# EAGLE design cell (EAGLE 7.5.0)
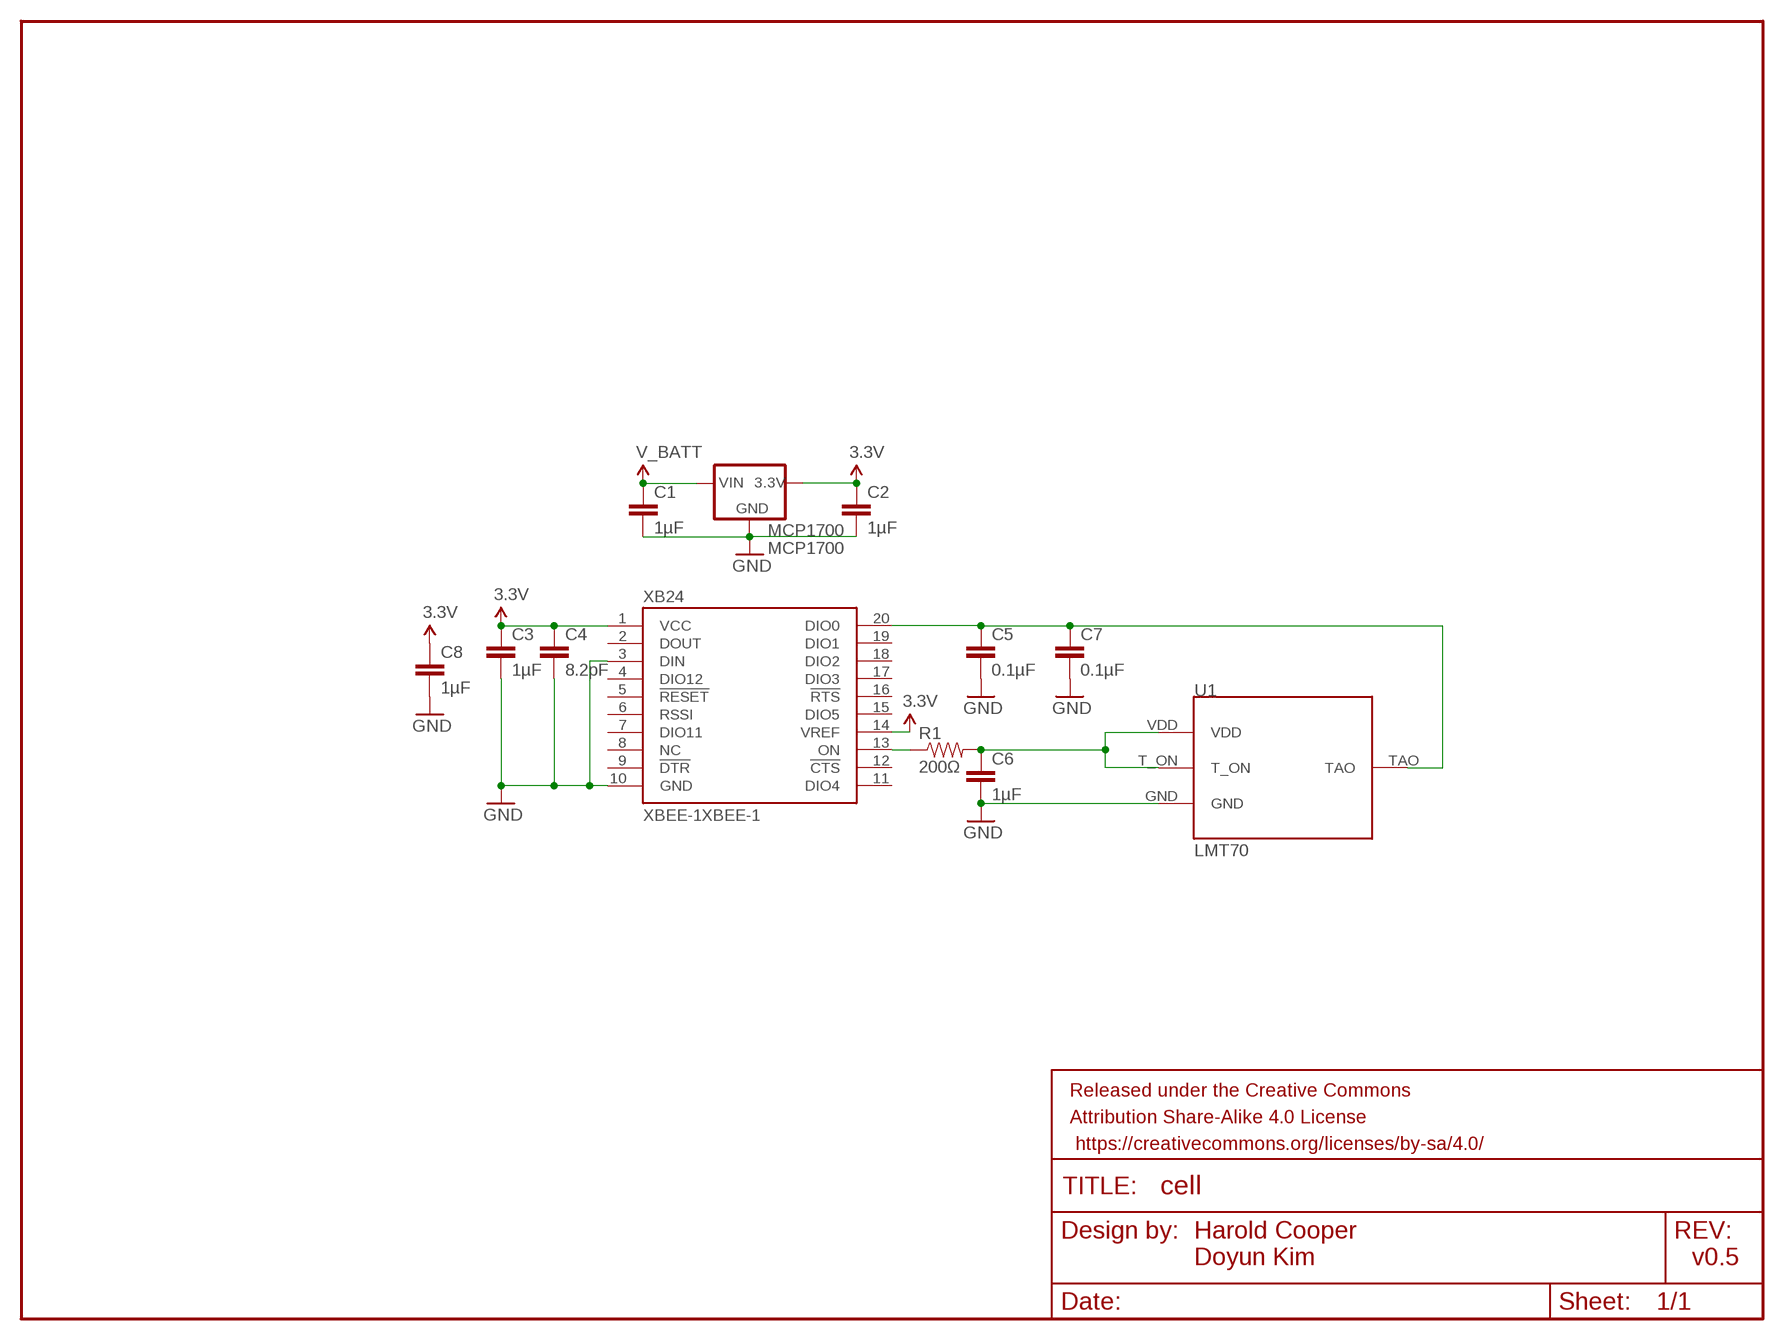
[diagram p0: schematic, sheet 1]

## Parts
C1  1µF  CAP0805  [0805]
C2  1µF  CAP0805  [0805]
C3  1µF  CAP0805  [0805]
C4  8.2pF  CAP0805  [0805]
C5  0.1µF  CAP0805  [0805]
C6  1µF  CAP0805  [0805]
C7  0.1µF  CAP0805  [0805]
C8  1µF  CAP0805  [0805]
FRAME1  FRAME-LETTER  [CREATIVE_COMMONS]
MCP1700  MCP1700  [SOT-89-3]
R1  200Ω  RESISTOR0805-RES  [0805]
U1  LMT70  [YFP0004]
XB24  XBEE-1XBEE-1  [XBEE-1]

## Nets
3.3V: C2.1 C3.1 C4.1 C8.1 MCP1700.3(3.3V) XB24.1(VCC) XB24.14(VREF)
GND: C1.2 C2.2 C3.2 C4.2 C5.2 C6.2 C7.2 C8.2 MCP1700.1(GND) U1.GND XB24.3(DIN) XB24.10(GND)
N$1: C6.1 R1.2 U1.T_ON U1.VDD
N$2: R1.1 XB24.13(ON)
N$7: C5.1 C7.1 U1.TAO XB24.20(DIO0)
V_BATT: C1.1 MCP1700.2(IN)
Unconnected: XB24.2(DOUT) XB24.4(DIO12) XB24.5(!RESET) XB24.6(RSSI) XB24.7(DIO11) XB24.8(NC) XB24.9(!DTR) XB24.11(DIO4) XB24.12(!CTS) XB24.15(DIO5) XB24.16(!RTS) XB24.17(DIO3) XB24.18(DIO2) XB24.19(DIO1)

## Notes on the sheet
- Harold Cooper
  Doyun Kim
- v0.5

## Library data of the parts
C1-C8 = SparkFun-Capacitors:CAP: Capacitor Standard 0603 ceramic capacitor, and 0.1" leaded capacitor.
FRAME1 = SparkFun-Aesthetics:FRAME-LETTER: Schematic Frame Standard 8.5x11 US Letter frame
MCP1700 = hrldcpr:MCP1700
R1 = SparkFun-Resistors:RESISTOR: Resistor Basic schematic elements and footprints for 0603, 1206, and PTH resistors.
U1 = lmt70:LMT70
XB24 = hrldcpr:XBEE-1: Xbee module footprints SMT header is CONN-09042.

## Board
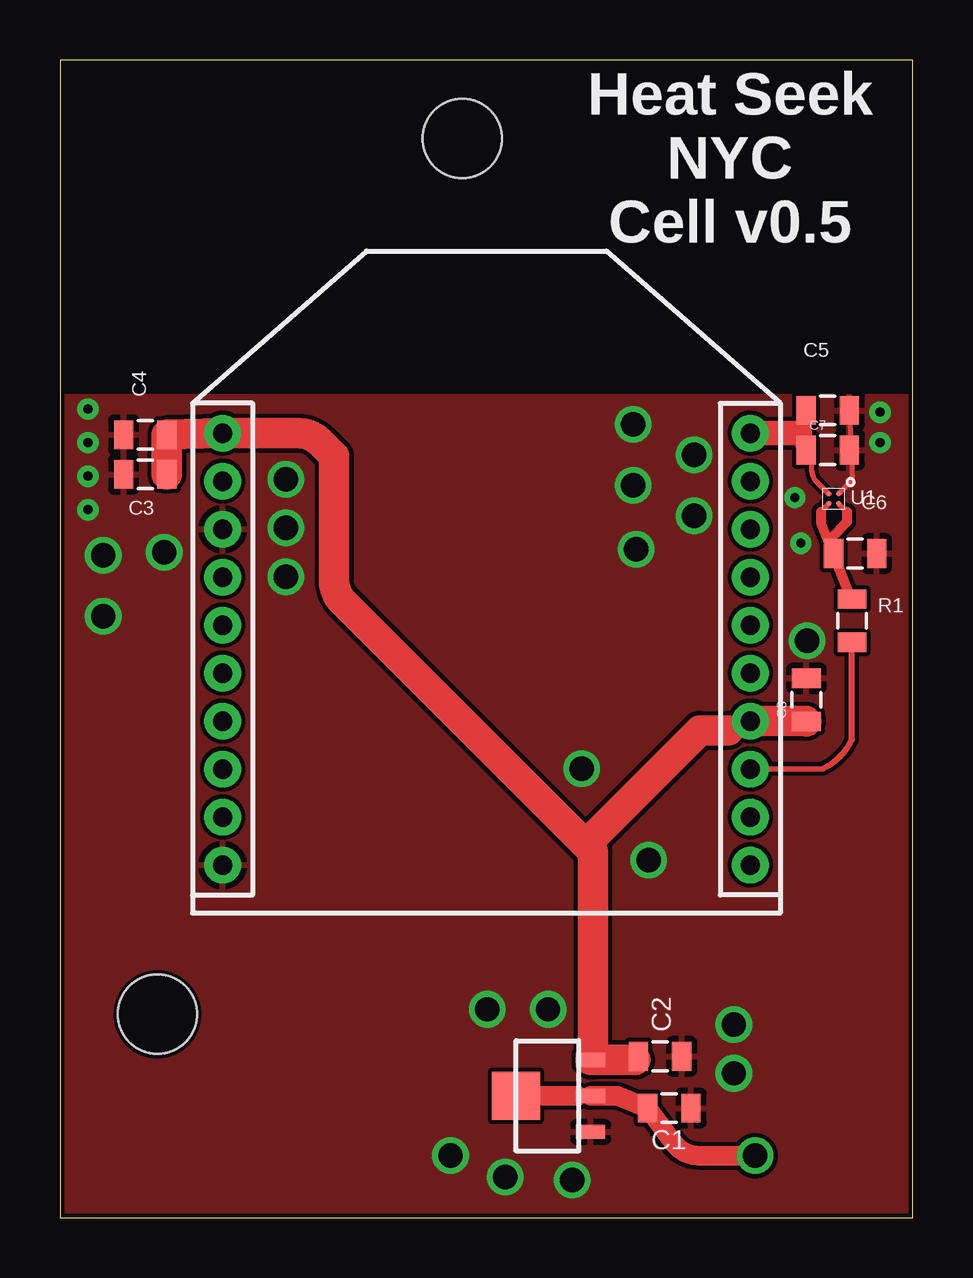
[diagram p1: board, top side]
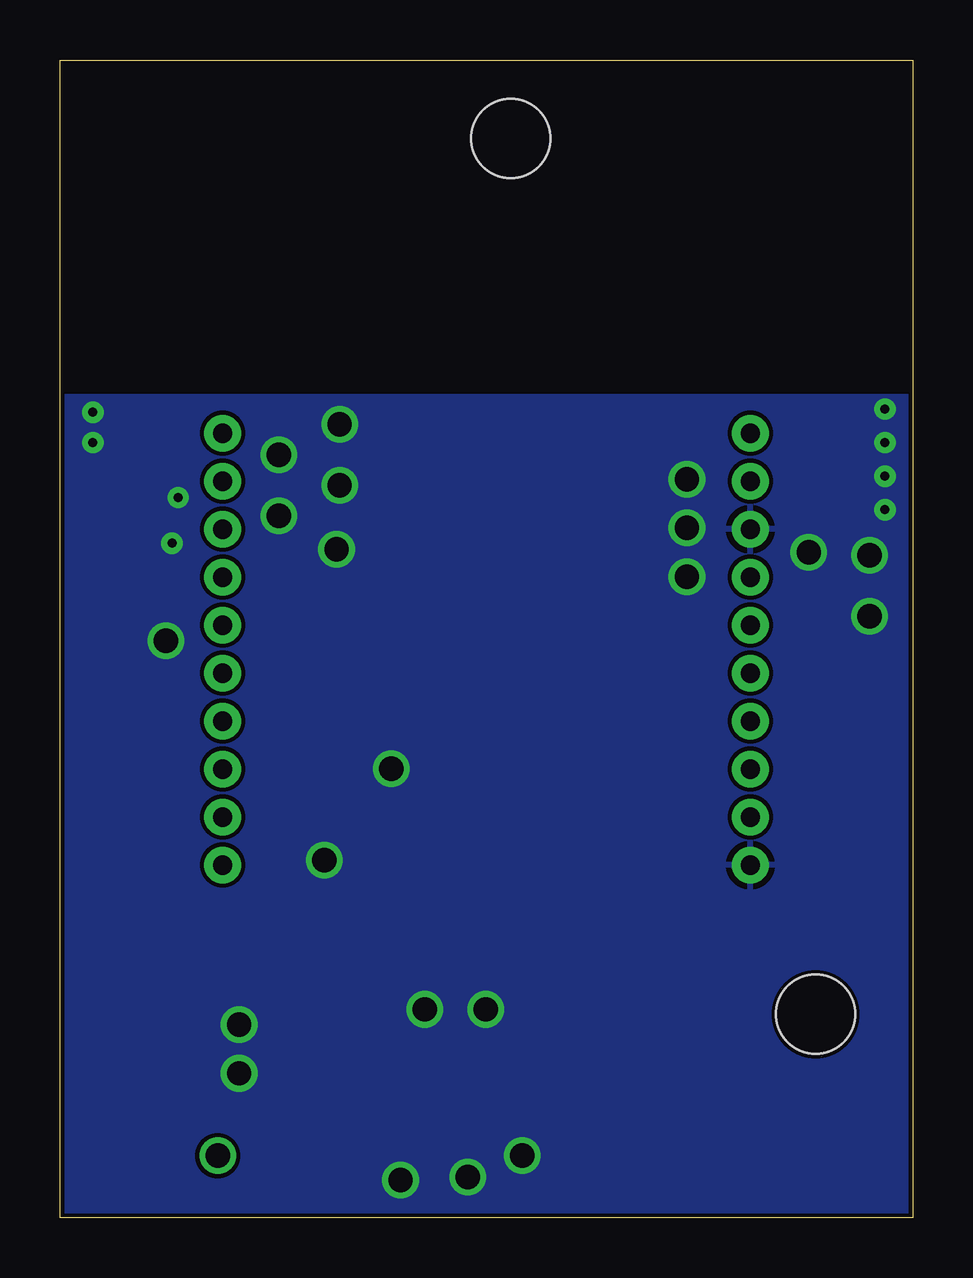
[diagram p2: board, bottom side, seen from below]

Size 35.56 x 48.26 mm. Coordinates in mm from the lower left corner, seen from the top.
Outline: 0,0 35.56,0 35.56,48.26 0,48.26 0,0
Copper layers (1*16): Top 0.035mm / dielectric 1.5mm / Bottom 0.035mm
Design rules "SparkFun-2-layer *": minimum track width 5mil, minimum drill 15mil, track to track 6mil, track to pad 6mil, pad to pad 6mil, via to via 6mil, smd to smd 6mil, copper to edge 5mil, drill to drill 5mil, minimum pad ring 12mil, minimum via ring 10mil, stop-mask expansion 4mil, vias tented up to drill 20mil, thermal gap 10mil
Holes 3.3 mm at 4.06,8.48 16.76,44.98
tRestrict: 1 lines

### Footprints (pad centres in the part's own frame; a part is rotated, then mirrored left to right if it is on the bottom)
0805 = smd 0.8 x 1.2: 1 -0.9,0; 2 0.9,0
SOT-89-3 = smd 0.58 x 1.2: 1 -1.5,-1.8; 2 0,-1.8; 3 1.5,-1.8 | smd 2 x 2: 4 0,1.3
YFP0004 = smd 0.205 x 0.205: GND -0.2,0.2; T_ON 0.2,-0.2; TAO -0.2,-0.2; VDD 0.2,0.2
XBEE-1 = drill 0.8 pad 1.524: 1 -11,20; 2 -11,18; 3 -11,16; 4 -11,14; 5 -11,12; 6 -11,10; 7 -11,8; 8 -11,6; 9 -11,4; 10 -11,2; 11 11,2; 12 11,4; 13 11,6; 14 11,8; 15 11,10; 16 11,12; 17 11,14; 18 11,16; 19 11,18; 20 11,20

### Placement (x,y rotation side)
C1  25.4,4.57 0 top
C2  25.02,6.73 0 top
C3  3.56,30.99 180 top
C4  3.56,32.64 180 top
C5  32,33.66 0 top
C6  33.15,27.69 0 top
C7  32,32 0 top
C8  31.11,21.59 90 top
FRAME1  0,60 0 top  (outside the outline)
MCP1700  20.32,5.08 90 top
R1  33.02,24.89 90 top
U1  32.26,29.97 270 top
XB24  17.78,12.7 0 top

### Tracks (layer width: path | path; a pad name or v marks a point on that pad's centre or on a via)
3.3V
  Top 0.254: 23.99,6.58 C2.1 | XB24.1 6.72,32.7
  Top 0.305: 22.23,6.58 MCP1700.3
  Top 0.813: 22.23,15.24 22.23,15.35 arc-45 22.09,15.74 | 27.87,20.32 arc45 XB24.14
  Top 1.27: C3.1 C4.1 6.72,32.7 | 23.99,6.58 MCP1700.3 | 22.23,6.58 22.23,15.24 11.8,25.66 arc-45 11.43,26.56 11.43,31.75 10.85,32.33 arc45 9.95,32.7 XB24.1 | 22.09,15.74 26.67,20.32 27.87,20.32 | XB24.14 31.09,20.7 arc-45 C8.1
GND  (via drill 0.38, 1.02)
  Top 0.206: C5.2 33.03,30.75 U1.GND
  other vias: 16.28,2.59 9.42,26.72 9.42,28.75 21.74,18.72 24.54,14.91 31.14,24.05 26.44,31.8 23.9,33.07 23.9,30.53 26.44,29.26 1.8,27.61 1.8,25.07 1.17,29.51 1.17,33.71 1.17,32.31 1.17,30.91 9.42,30.78 4.34,27.74 20.35,8.69 17.81,8.69 18.57,1.7 21.36,1.57 28.09,8.05 28.09,6.02 24.03,27.86 30.63,30.02 30.89,28.12 34.19,33.58 34.19,32.31
  pour Top (isolate 0.178): 0,0 0,34.29 35.56,34.29 35.56,0
  pour Bottom (isolate 0.178): 0,0 0,34.29 35.56,34.29 35.56,0
N$1
  Top 0.206: U1.VDD 32.81,29.42 | U1.T_ON 31.72,29.43
  Top 0.254: R1.2 C6.1
  Top 0.406: C6.1 arc90 32.13,27.95 | 32.13,27.95 32.13,28.32 32.81,29 32.81,29.42 | 32.13,27.95 32.89,26.03 32.14,27.93 31.72,28.98 31.72,29.43
N$2
  Top 0.254: XB24.13 31.81,18.73 arc41 33.01,19.93 R1.1
N$5
  Top 0.813: 21.59,5.08 19.05,5.08
N$7
  Top 0.206: 30.85,32.7 31.36,31.51 arc45 31.45,30.78 U1.TAO
  Top 0.254: 30.85,32.7 C5.1
  Top 0.406: 30.48,32.7 30.77,32.41 arc-45 30.86,32.19 30.92,32.19 C7.1
  Top 1.016: XB24.20 30.48,32.7 30.85,32.7
V_BATT  (via drill 1.02)
  Top 0.813: v28.98,2.59 26.61,2.59 arc-53 25.59,3.1 C1.1 23.23,5.08 MCP1700.2

### Text on the board
tPlace: Heat Seek / NYC / Cell v0.5
tDocu: Harold Cooper, Doyun Kim